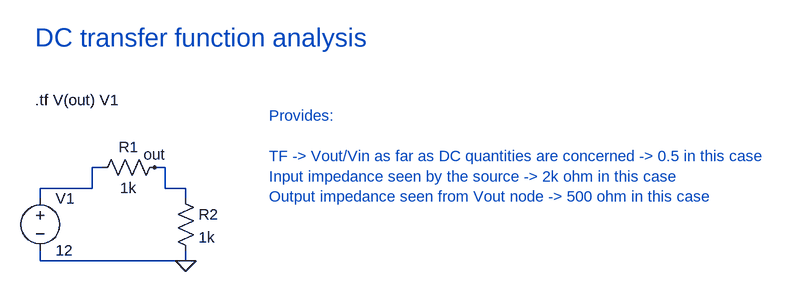
[diagram p0: schematic DC-transfer-function-analysis.asc]
DC-transfer-function-analysis.asc, the LTspice schematic file:
Version 4.1
SHEET 1 1132 680
WIRE 208 192 208 208
WIRE -16 192 -16 208
WIRE 208 208 -16 208
FLAG 208 208 0
WIRE 80 64 64 64
WIRE -16 112 -16 96
WIRE 64 64 64 96
WIRE 64 96 -16 96
WIRE 160 64 176 64
WIRE 208 112 208 96
WIRE 176 64 176 96
WIRE 176 96 208 96
FLAG 160 64 out
SYMBOL voltage -16 96 R0
WINDOW 123 0 0 Left 0
WINDOW 39 0 0 Left 0
SYMATTR InstName V1
SYMATTR Value 12
SYMBOL res 176 48 R90
WINDOW 0 0 56 VBottom 2
WINDOW 3 32 56 VTop 2
SYMATTR InstName R1
SYMATTR Value 1k
SYMBOL res 192 96 R0
SYMATTR InstName R2
SYMATTR Value 1k
TEXT -24 -40 Left 2 !.tf V(out) V1
TEXT -24 -136 Left 4 ;DC transfer function analysis
TEXT 336 -16 Left 2 ;Provides:\n \nTF -> Vout/Vin as far as DC quantities are concerned -> 0.5 in this case\nInput impedance seen by the source -> 2k ohm in this case\nOutput impedance seen from Vout node -> 500 ohm in this case

The netlist it stands for:
* DC-transfer-function-analysis.asc
V1 N001 0 12
R1 out N001 1k
R2 out 0 1k
.tf V(out) V1
* DC transfer function analysis
* Provides:
* TF -> Vout/Vin as far as DC quantities are concerned -> 0.5 in this case
* Input impedance seen by the source -> 2k ohm in this case
* Output impedance seen from Vout node -> 500 ohm in this case
.backanno
.end